# EAGLE design sistem minimum Atmega8 (EAGLE 9.6.1)
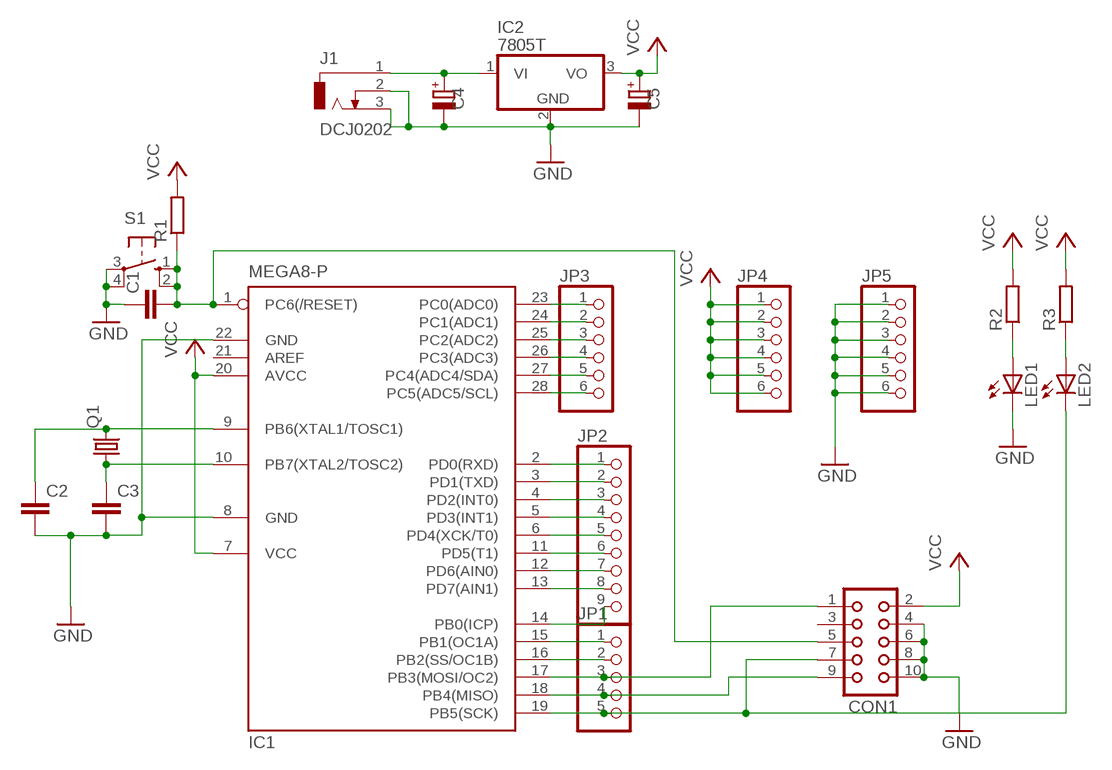
[diagram p0: schematic, sheet 1]

## Parts
C1  C-EU025-030X050  [C025-030X050]
C2  C-EU025-030X050  [C025-030X050]
C3  C-EU025-030X050  [C025-030X050]
C4  CPOL-EUE2.5-6  [E2,5-6]
C5  CPOL-EUE2.5-6  [E2,5-6]
CON1  CON10  [CON10]
IC1  MEGA8-P  [DIL28-3]
IC2  7805T  [TO220H]
J1  DCJ0202  [DCJ0202]
JP1  PINHD-1X5  [1X05]
JP2  PINHD-1X9  [1X09]
JP3  PINHD-1X6  [1X06]
JP4  PINHD-1X6  [1X06]
JP5  PINHD-1X6  [1X06]
LED1  LED3MM  [LED3MM]
LED2  LED3MM  [LED3MM]
Q1  CRYSTALHC49U-V  [HC49U-V]
R1  R-EU_0204/7  [0204/7]
R2  R-EU_0204/7  [0204/7]
R3  R-EU_0204/7  [0204/7]
S1  10-XX  [B3F-10XX]

## Nets
GND: C1.1 C2.2 C3.2 C4.- C5.- CON1.4 CON1.6 CON1.8 CON1.10 IC1.8(GND) IC1.22(GND) IC2.2(GND) J1.2 J1.3 JP5.1 JP5.2 JP5.3 JP5.4 JP5.5 JP5.6 LED1.K(C) S1.3(P) S1.4(P1)
N$1: IC1.2(PD0(RXD)) JP2.1
N$2: IC1.3(PD1(TXD)) JP2.2
N$3: IC1.4(PD2(INT0)) JP2.3
N$4: IC1.5(PD3(INT1)) JP2.4
N$5: IC1.6(PD4(XCK/T0)) JP2.5
N$6: IC1.11(PD5(T1)) JP2.6
N$7: IC1.12(PD6(AIN0)) JP2.7
N$8: IC1.13(PD7(AIN1)) JP2.8
N$9: IC1.14(PB0(ICP)) JP2.9
N$10: IC1.15(PB1(OC1A)) JP1.1
N$11: IC1.16(PB2(SS/OC1B)) JP1.2
N$12: CON1.1 IC1.17(PB3(MOSI/OC2)) JP1.3
N$13: CON1.9 IC1.18(PB4(MISO)) JP1.4
N$14: C4.+ IC2.1(VI) J1.1
N$15: IC1.23(PC0(ADC0)) JP3.1
N$16: IC1.24(PC1(ADC1)) JP3.2
N$17: IC1.25(PC2(ADC2)) JP3.3
N$18: IC1.26(PC3(ADC3)) JP3.4
N$19: IC1.27(PC4(ADC4/SDA)) JP3.5
N$20: IC1.28(PC5(ADC5/SCL)) JP3.6
N$21: C2.1 IC1.9(PB6(XTAL1/TOSC1)) Q1.2
N$22: C3.1 IC1.10(PB7(XTAL2/TOSC2)) Q1.1
N$23: C1.2 CON1.5 IC1.1(PC6(/RESET)) R1.1 S1.1(S) S1.2(S1)
N$24: LED2.A R3.1
N$25: CON1.7 IC1.19(PB5(SCK)) JP1.5 LED2.K(C)
N$33: LED1.A R2.1
VCC: C5.+ CON1.2 IC1.7(VCC) IC1.20(AVCC) IC2.3(VO) JP4.1 JP4.2 JP4.3 JP4.4 JP4.5 JP4.6 R1.2 R2.2 R3.2
Unconnected: CON1.3 IC1.21(AREF)

## Library data of the parts
C1-C3 = rcl:C-EU: CAPACITOR, European symbol
C4 C5 = rcl:CPOL-EU: POLARIZED CAPACITOR, European symbol; SPICEPREFIX: C
CON1 = con-harting:CON10: CONNECTOR; OC_FARNELL: unknown; OC_NEWARK: unknown
IC1 = atmel:MEGA8-P: MICROCONTROLLER 8 Kbytes FLASH, 1 kbytes SRAM, 512 bytes EEPROM, USART, 4-channel 10 bit ADC, 2-channel 8 bit ADC Pin compatible with Atmega48, ATMega88, ATMega168 Source: avr.lbr; OC_FARNELL: unknown; OC_NEWARK: unknown
IC2 = linear:78*: Positive VOLTAGE REGULATOR Source: http://cache.national.com/ds/LM/LM78L05.pdf http://www.fairchildsemi.com/ds/LM/LM7805.pdf
J1 = con-jack:DCJ0202: DC POWER JACK Source: DCJ0202.pdf; OC_FARNELL: unknown; OC_NEWARK: unknown
JP1 = pinhead:PINHD-1X5: PIN HEADER
JP2 = pinhead:PINHD-1X9: PIN HEADER
JP3-JP5 = pinhead:PINHD-1X6: PIN HEADER
LED1 LED2 = led:LED: LED OSRAM: - CHIPLED LG R971, LG N971, LY N971, LG Q971, LY Q971, LO R971, LY R971 LH N974, LH R974 LS Q976, LO Q976, LY Q976 LO Q996 - Hyper CHIPLED LW Q18S LB Q993, LB Q99A, LB R99A - SideLED LS A670, LO A670, LY A670, LG A670, LP A670 LB A673, LV A673, LT A673, LW A673 LH A674 LY A675 LS A676, LA A676, LO A676, LY A676, LW A676 LS A679, LY A679, LG A679 - Hyper Micro SIDELED® LS Y876, LA Y876, LO Y876, LY Y876 LT Y87S - SmartLED LW L88C, LW L88S LB L89C, LB L89S, LG L890 LS L89K, LO L89K, LY L89K LS L896, LA L896, LO L896, LY L896 - TOPLED LS T670, LO T670, LY T670, LG T670, LP T670 LSG T670, LSP T670, LSY T670, LOP T670, LYG T670 LG T671, LOG T671, LSG T671 LB T673, LV T673, LT T673, LW T673 LH T674 LS T676, LA T676, LO T676, LY T676, LB T676, LH T676, LSB T676, LW T676 LB T67C, LV T67C, LT T67C, LS T67K, LO T67K, LY T67K, LW E67C LS E67B, LA E67B, LO E67B, LY E67B, LB E67C, LV E67C, LT E67C LW T67C LS T679, LY T679, LG T679 LS T770, LO T770, LY T770, LG T770, LP T770 LB T773, LV T773, LT T773, LW T773 LH T774 LS E675, LA E675, LY E675, LS T675 LS T776, LA T776, LO T776, LY T776, LB T776 LHGB T686 LT T68C, LB T68C - Hyper Mini TOPLED® LB M676 - Mini TOPLED Santana® LG M470 LS M47K, LO M47K, LY M47K Source: http://www.osram.convergy.de LUXEON: - LUMILED® LXK2-PW12-R00, LXK2-PW12-S00, LXK2-PW14-U00, LXK2-PW14-V00 LXK2-PM12-R00, LXK2-PM12-S00, LXK2-PM14-U00 LXK2-PE12-Q00, LXK2-PE12-R00, LXK2-PE12-S00, LXK2-PE14-T00, LXK2-PE14-U00 LXK2-PB12-K00, LXK2-PB12-L00, LXK2-PB12-M00, LXK2-PB14-N00, LXK2-PB14-P00, LXK2-PB14-Q00 LXK2-PR12-L00, LXK2-PR12-M00, LXK2-PR14-Q00, LXK2-PR14-R00 LXK2-PD12-Q00, LXK2-PD12-R00, LXK2-PD12-S00 LXK2-PH12-R00, LXK2-PH12-S00 LXK2-PL12-P00, LXK2-PL12-Q00, LXK2-PL12-R00 Source: www.luxeon.com KINGBRIGHT: KA-3528ASYC Source: www.kingbright.com
Q1 = crystal:CRYSTAL: CRYSTAL; OC_FARNELL: 1666969; OC_NEWARK: unknown
R1-R3 = rcl:R-EU_: RESISTOR, European symbol
S1 = switch-omron:10-XX: OMRON SWITCH; MPN: B3F-1000; OC_FARNELL: 176432; OC_NEWARK: 36M3542

## Board
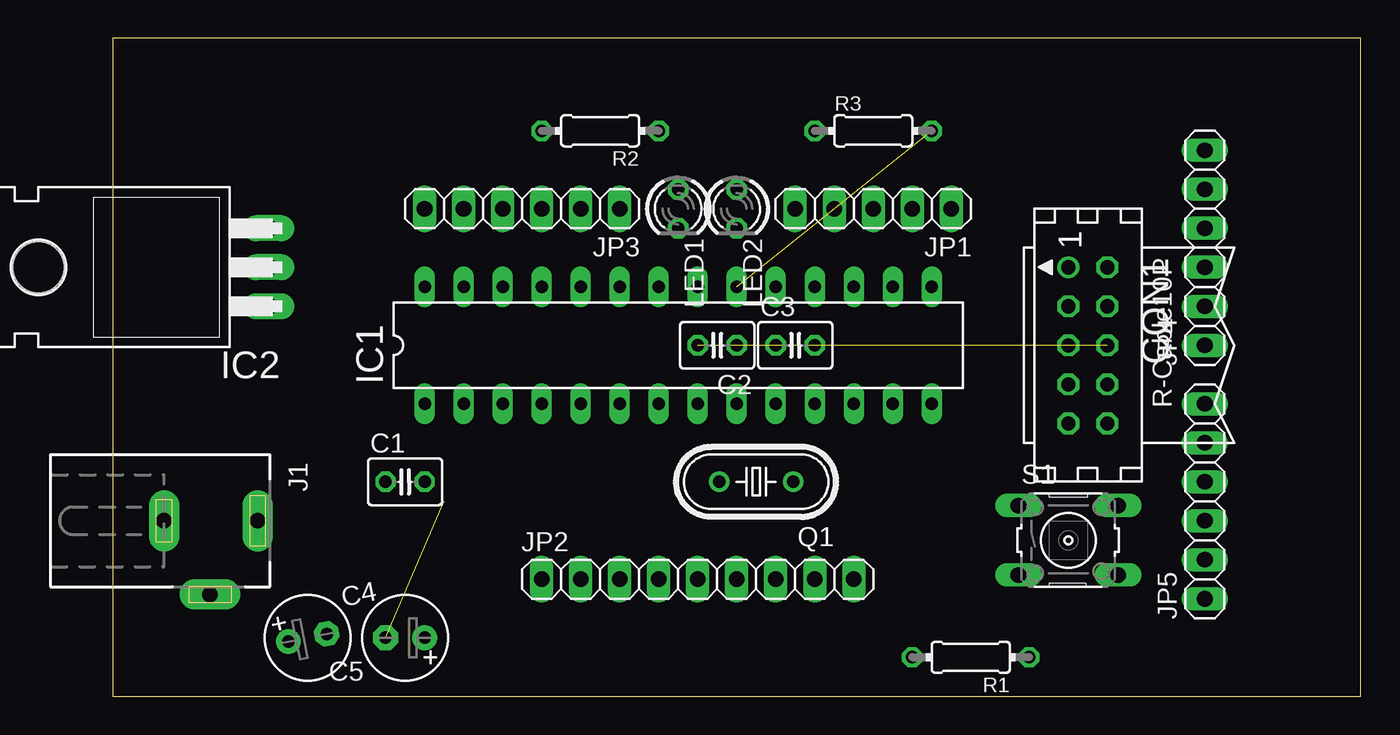
[diagram p1: board, top side]
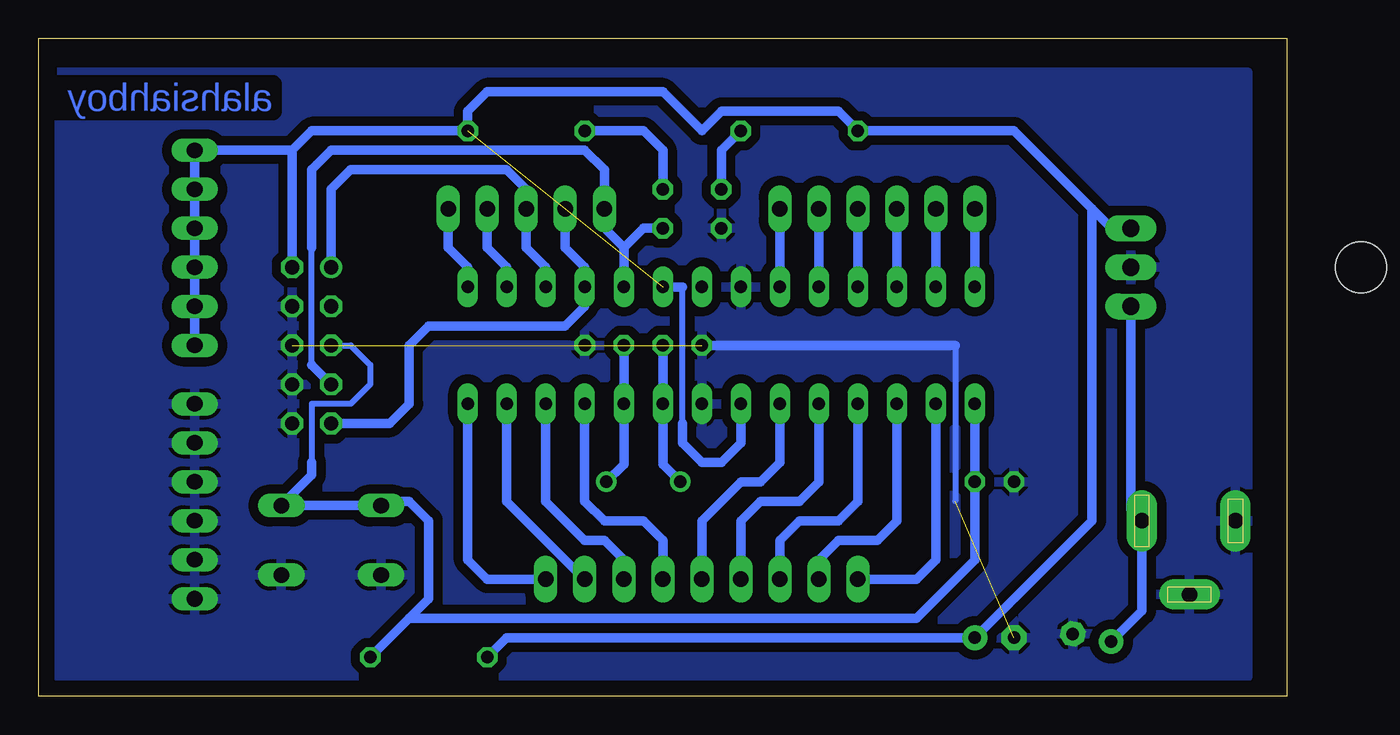
[diagram p2: board, bottom side, seen from below]

Size 81.26 x 42.85 mm. Coordinates in mm from the lower left corner, seen from the top.
Outline: 0,0 81.26,0 81.26,42.85 0,42.85 0,0
Copper layers (1*16): Top 0.035mm / dielectric 1.5mm / Bottom 0.035mm
Design rules "default": minimum track width 10mil, minimum drill 24mil, track to track 8mil, track to pad 8mil, pad to pad 8mil, via to via 8mil, smd to smd 8mil, copper to edge 40mil, drill to drill 8mil, minimum pad ring 10mil, minimum via ring 8mil, stop-mask expansion 4mil, vias tented up to drill 0mil, thermal gap 10mil

### Footprints (pad centres in the part's own frame; a part is rotated, then mirrored left to right if it is on the bottom)
C025-030X050 = drill 0.813 octagon: 1 -1.27,0; 2 1.27,0
E2,5-6 = drill 0.813 pad 1.6: + -1.27,0 | drill 0.813 pad 1.6 octagon: - 1.27,0
CON10 = drill 0.914: 1 -5.08,-1.27 | drill 0.914 octagon: 2 -5.08,1.27; 3 -2.54,-1.27; 4 -2.54,1.27; 5 0,-1.27; 6 0,1.27; 7 2.54,-1.27; 8 2.54,1.27; 9 5.08,-1.27; 10 5.08,1.27
DIL28-3 = drill 0.813 long: 1 -16.51,-3.81; 2 -13.97,-3.81; 3 -11.43,-3.81; 4 -8.89,-3.81; 5 -6.35,-3.81; 6 -3.81,-3.81; 7 -1.27,-3.81; 8 1.27,-3.81; 9 3.81,-3.81; 10 6.35,-3.81; 11 8.89,-3.81; 12 11.43,-3.81; 13 13.97,-3.81; 14 16.51,-3.81; 15 16.51,3.81; 16 13.97,3.81; 17 11.43,3.81; 18 8.89,3.81; 19 6.35,3.81; 20 3.81,3.81; 21 1.27,3.81; 22 -1.27,3.81; 23 -3.81,3.81; 24 -6.35,3.81; 25 -8.89,3.81; 26 -11.43,3.81; 27 -13.97,3.81; 28 -16.51,3.81
TO220H = drill 1.118 long: 1 -2.54,-10.16; 2 0,-10.16; 3 2.54,-10.16 | hole 3.302: 0,4.826
DCJ0202 = drill 1 pad 2 long: 1 0,3.1; 2 4.8,0; 3 0,-3
1X05 = drill 1.016 long: 1 -5.08,0; 2 -2.54,0; 3 0,0; 4 2.54,0; 5 5.08,0
1X09 = drill 1.016 long: 1 -10.16,0; 2 -7.62,0; 3 -5.08,0; 4 -2.54,0; 5 0,0; 6 2.54,0; 7 5.08,0; 8 7.62,0; 9 10.16,0
1X06 = drill 1.016 long: 1 -6.35,0; 2 -3.81,0; 3 -1.27,0; 4 1.27,0; 5 3.81,0; 6 6.35,0
LED3MM = drill 0.813 octagon: A -1.27,0; K 1.27,0
HC49U-V = drill 0.813: 1 -2.413,0; 2 2.413,0
0204/7 = drill 0.813 octagon: 1 -3.81,0; 2 3.81,0
B3F-10XX = drill 1.016 long: 1 -3.251,2.261; 2 3.251,2.261; 3 -3.251,-2.261; 4 3.251,-2.261

### Placement (x,y rotation side)
C1  19.05,13.97 0 top
C2  39.37,22.86 180 top
C3  44.45,22.86 0 top
C4  12.7,3.81 11.3 top
C5  19.05,3.81 180 top
CON1  63.5,22.86 270 top
IC1  36.83,22.86 0 top
IC2  0,27.94 90 top
J1  6.35,11.43 270 top
JP1  49.53,31.75 180 top
JP2  38.1,7.62 0 top
JP3  26.67,31.75 180 top
JP4  71.12,29.21 90 top
JP5  71.12,12.7 90 top
LED1  36.83,31.75 270 top
LED2  40.64,31.75 270 top
Q1  41.91,13.97 180 top
R1  55.88,2.54 180 top
R2  31.75,36.83 180 top
R3  49.53,36.83 0 top
S1  62.23,10.16 0 top

### Tracks (layer width: path | path; a pad name or v marks a point on that pad's centre or on a via)
GND  (3 unrouted)
  Bottom 0.406: 21.59,22.86 21.59,12.7
  Bottom 0.61: C2.2 21.59,22.86
  pour Bottom (isolate 0.61): 2.54,40.64 80.01,40.64 80.01,1.27 2.54,1.27
N$1
  Bottom 0.61: IC1.2 22.86,8.89 24.13,7.62 JP2.1
N$2
  Bottom 0.61: JP2.2 30.48,8.89 29.21,10.16 26.67,10.16 25.4,11.43 IC1.3
N$3
  Bottom 0.61: JP2.3 33.02,10.16 31.75,11.43 29.21,11.43 27.94,12.7 IC1.4
N$4
  Bottom 0.61: JP2.4 35.56,11.43 34.29,12.7 31.75,12.7 30.48,13.97 IC1.5
N$5
  Bottom 0.61: JP2.5 38.1,11.43 35.56,13.97 34.29,13.97 33.02,15.24 IC1.6
N$6
  Bottom 0.61: JP2.6 40.64,10.16 41.91,11.43 44.45,11.43 45.72,12.7 IC1.11
N$7
  Bottom 0.61: JP2.7 43.18,8.89 44.45,10.16 45.72,10.16 48.26,12.7 IC1.12
N$8
  Bottom 0.61: JP2.8 50.8,12.7 IC1.13
N$9
  Bottom 0.61: JP2.9 52.07,7.62 53.34,8.89 IC1.14
N$10
  Bottom 0.61: JP1.1 54.61,29.21 53.34,27.94 IC1.15
N$11
  Bottom 0.61: JP1.2 52.07,29.21 50.8,27.94 IC1.16
N$12
  Bottom 0.61: IC1.17 48.26,27.94 49.53,29.21 JP1.3 49.53,33.02 50.8,34.29 60.96,34.29 62.23,33.02 CON1.1
N$13
  Bottom 0.61: JP1.4 46.99,29.21 45.72,27.94 IC1.18 45.72,25.4 46.99,24.13 55.88,24.13 57.15,22.86 57.15,19.05 58.42,17.78 CON1.9
N$14
  Bottom 0.61: IC2.1 10.16,12.14 J1.1 9.45,5.57 C4.+
N$15
  Bottom 0.61: JP3.1 IC1.23
N$16
  Bottom 0.61: JP3.2 IC1.24
N$17
  Bottom 0.61: JP3.3 IC1.25
N$18
  Bottom 0.61: JP3.4 IC1.26
N$19
  Bottom 0.61: JP3.5 IC1.27
N$20
  Bottom 0.61: JP3.6 IC1.28
N$21
  Bottom 0.61: Q1.2 40.64,15.11 IC1.9 C2.1
N$22
  Bottom 0.61: Q1.1 43.18,15.11 IC1.10 C3.1
N$23
  Bottom 0.406: CON1.5 60.96,22.86 59.69,21.59 59.69,20.32 60.96,19.05 63.5,19.05 63.5,15.24
  Bottom 0.61: 63.5,15.24 63.5,14.4 S1.2 S1.1 58.7,12.7 57.15,12.7 55.88,11.43 55.88,6.35 R1.1 57.15,5.08 24.13,5.08 20.32,8.89 C1.2 IC1.1
N$24
  Bottom 0.61: R3.1 41.91,36.83 40.64,35.56 LED2.A
N$25
  Bottom 0.406: 63.5,21.59 63.5,29.21
  Bottom 0.61: LED2.K 41.91,30.48 43.18,29.21 | IC1.19 43.18,29.21 | 43.18,29.21 44.45,30.48 JP1.5 44.45,34.29 45.72,35.56 62.23,35.56 63.5,34.29 63.5,29.21 | CON1.7 63.5,21.59
N$33
  Bottom 0.61: LED1.A 36.83,35.56 R2.1
VCC  (1 unrouted)
  Bottom 0.406: 39.37,17.78 39.37,26.67
  Bottom 0.61: 12.7,31.75 17.78,36.83 R2.2 29.21,38.1 36.83,38.1 38.1,36.83 40.64,39.37 52.07,39.37 53.34,38.1 R3.2 63.5,36.83 64.77,35.56 | 12.7,31.75 11.43,30.48 IC2.3 | IC1.7 35.56,16.51 36.83,15.24 38.1,15.24 39.37,16.51 39.37,17.78 | IC1.20 39.37,26.67 | 64.77,35.56 CON1.2 | R1.2 50.8,3.81 C5.+ 12.7,11.43 12.7,31.75 | 64.77,35.56 JP4.6 JP4.5 JP4.4 JP4.3 JP4.2 JP4.1

### Text on the board
Bottom: alahsiahboy